# Altium schematic sheet Squib Driver.SchDoc
size A
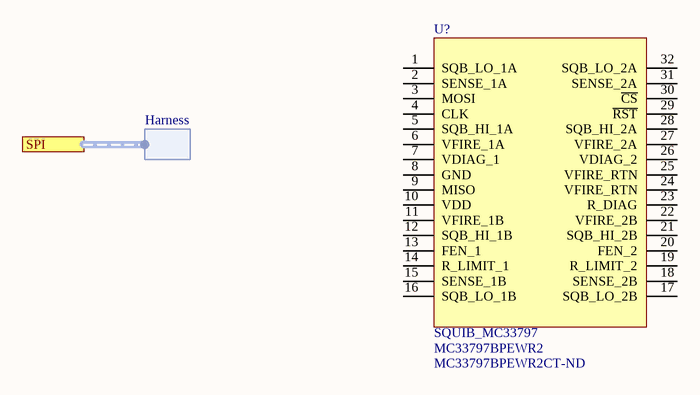
[diagram p0: Squib Driver.SchDoc]

## Parts
U?  SQUIB_MC33797  Manufacturer Part Number: MC33797BPEWR2  Supplier Part Number 1: MC33797BPEWR2CT-ND  [SOT1762-1]

## Ports
SPI (harness Harness)

## Harnesses
Harness: 

## Nets

Not connected (* = marked no-connect by the designer): U? 1(SQB_LO_1A) 2(SENSE_1A) 3(MOSI) 4(CLK) 5(SQB_HI_1A) 6(VFIRE_1A) 7(VDIAG_1) 8(GND) 9(MISO) 10(VDD) 11(VFIRE_1B) 12(SQB_HI_1B) 13(FEN_1) 14(R_LIMIT_1) 15(SENSE_1B) 16(SQB_LO_1B) 17(SQB_LO_2B) 18(SENSE_2B) 19(R_LIMIT_2) 20(FEN_2) 21(SQB_HI_2B) 22(VFIRE_2B) 23(R_DIAG) 24(VFIRE_RTN) 25(VFIRE_RTN) 26(VDIAG_2) 27(VFIRE_2A) 28(SQB_HI_2A) 29(~{RST}) 30(~{CS}) 31(SENSE_2A) 32(SQB_LO_2A)

## Library data of the parts
U? = SQUIB_MC33797: Manufacturer: NXP USA Inc.; Interface: SPI; Voltage - Supply: 4.75 V ~ 5.25 V; RoHS: RoHS Compliant; Category: Integrated Circuits (ICs); Packaging: Cut Tape (CT); Part Status: Active; Applications: -; Package / Case: 32-SOIC (0.295", 7.50mm Width); Supplier Device Package: 32-SOIC; Mounting Type: Surface Mount; ComponentLink1URL: http://cache.freescale.com/files/analog/doc/data_sheet/MC33797.pdf; ComponentLink1Description: http://cache.freescale.com/files/analog/doc/data_sheet/MC33797.pdf; Supplier 1: Digi-Key